# Altium schematic sheet Cube.SchDoc
size A4; SheetNumber: 5; SheetTotal: 5
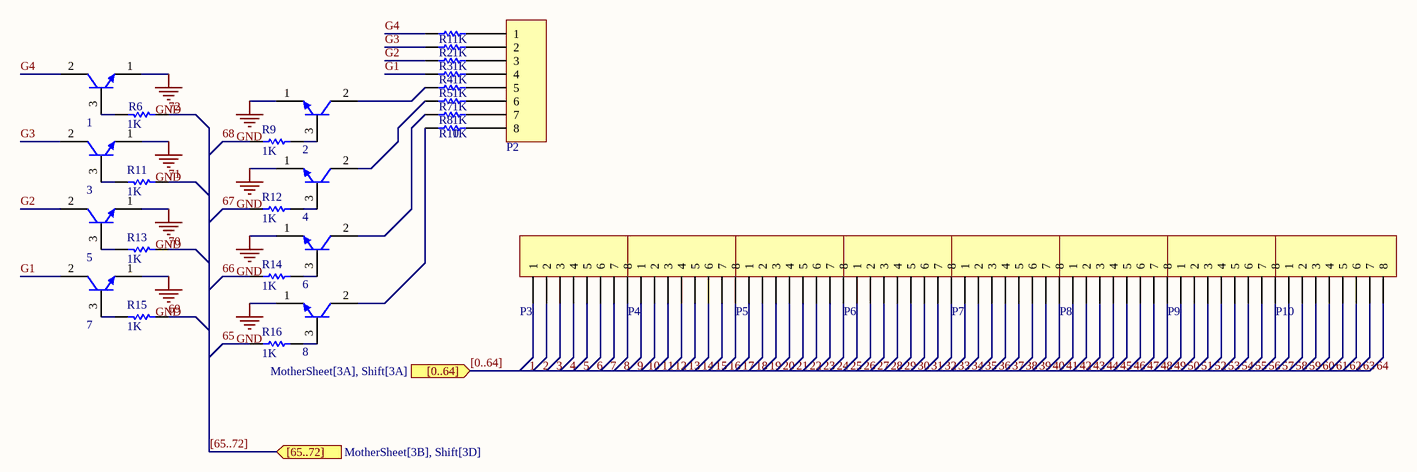
[diagram p0: Cube.SchDoc]

## Parts
1  C1815  [QTO-92]  (value not drawn)
2  C1815  [QTO-92]  (value not drawn)
3  C1815  [QTO-92]  (value not drawn)
4  C1815  [QTO-92]  (value not drawn)
5  C1815  [QTO-92]  (value not drawn)
6  C1815  [QTO-92]  (value not drawn)
7  C1815  [QTO-92]  (value not drawn)
8  C1815  [QTO-92]  (value not drawn)
P2  Header 8  [JP8]  (value not drawn)
P3  Header 8  [JP8]  (value not drawn)
P4  Header 8  [JP8]  (value not drawn)
P5  Header 8  [JP8]  (value not drawn)
P6  Header 8  [JP8]  (value not drawn)
P7  Header 8  [JP8]  (value not drawn)
P8  Header 8  [JP8]  (value not drawn)
P9  Header 8  [JP8]  (value not drawn)
P10  Header 8  [JP8]  (value not drawn)
R1  value 1K  [RES 1/2W]  (hidden comment: RESISTOR)
R2  value 1K  [RES 1/2W]  (hidden comment: RESISTOR)
R3  value 1K  [RES 1/2W]  (hidden comment: RESISTOR)
R4  value 1K  [RES 1/2W]  (hidden comment: RESISTOR)
R5  value 1K  [RES 1/2W]  (hidden comment: RESISTOR)
R6  value 1K  [RES 1/2W]  (hidden comment: RESISTOR)
R7  value 1K  [RES 1/2W]  (hidden comment: RESISTOR)
R8  value 1K  [RES 1/2W]  (hidden comment: RESISTOR)
R9  value 1K  [RES-SM-0805]  (hidden comment: RESISTOR SMD)
R10  value 1K  [RES 1/2W]  (hidden comment: RESISTOR)
R11  value 1K  [RES 1/2W]  (hidden comment: RESISTOR)
R12  value 1K  [RES 1/2W]  (hidden comment: RESISTOR)
R13  value 1K  [RES 1/2W]  (hidden comment: RESISTOR)
R14  value 1K  [RES 1/2W]  (hidden comment: RESISTOR)
R15  value 1K  [RES 1/2W]  (hidden comment: RESISTOR)
R16  value 1K  [RES 1/2W]  (hidden comment: RESISTOR)

## Ports
[0..64] (in, see MotherSheet[3A], Shift[3A]), [65..72] (in, see MotherSheet[3B], Shift[3D])

## Nets
GND: 1.1(E) 2.1(E) 3.1(E) 4.1(E) 5.1(E) 6.1(E) 7.1(E) 8.1(E)
1: P3.1
2: P3.2
3: P3.3
4: P3.4
5: P3.5
6: P3.6
7: P3.7
8: P3.8
9: P4.1
10: P4.2
11: P4.3
12: P4.4
13: P4.5
14: P4.6
15: P4.7
16: P4.8
17: P5.1
18: P5.2
19: P5.3
20: P5.4
21: P5.5
22: P5.6
23: P5.7
24: P5.8
25: P6.1
26: P6.2
27: P6.3
28: P6.4
29: P6.5
30: P6.6
31: P6.7
32: P6.8
33: P7.1
34: P7.2
35: P7.3
36: P7.4
37: P7.5
38: P7.6
39: P7.7
40: P7.8
41: P8.1
42: P8.2
43: P8.3
44: P8.4
45: P8.5
46: P8.6
47: P8.7
48: P8.8
49: P9.1
50: P9.2
51: P9.3
52: P9.4
53: P9.5
54: P9.6
55: P9.7
56: P9.8
57: P10.1
58: P10.2
59: P10.3
60: P10.4
61: P10.5
62: P10.6
63: P10.7
64: P10.8
65: R16.1
66: R14.1
67: R12.1
68: R9.1
69: R15.1
70: R13.1
71: R11.1
72: R6.1
G1: 7.2(C) R4.1
G2: 5.2(C) R3.1
G3: 3.2(C) R2.1
G4: 1.2(C) R1.1
Net1_3: 1.3(B) R6.2
Net2_2: 2.2(C) R5.1
Net2_3: 2.3(B) R9.2
Net3_3: 3.3(B) R11.2
Net4_2: 4.2(C) R7.1
Net4_3: 4.3(B) R12.2
Net5_3: 5.3(B) R13.2
Net6_2: 6.2(C) R8.1
Net6_3: 6.3(B) R14.2
Net7_3: 7.3(B) R15.2
Net8_2: 8.2(C) R10.1
Net8_3: 8.3(B) R16.2
NetP2_1: P2.1 R1.2
NetP2_2: P2.2 R2.2
NetP2_3: P2.3 R3.2
NetP2_4: P2.4 R4.2
NetP2_5: P2.5 R5.2
NetP2_6: P2.6 R7.2
NetP2_7: P2.7 R8.2
NetP2_8: P2.8 R10.2

## Buses and harness runs
bus [0..64] = port [0..64]
bus [65..72] = port [65..72]

## Library data of the parts
1-8 = C1815: NPN Bipolar Transistor
P2-P10 = Header 8: Header, 8-Pin; LatestRevisionDate: 17-Jul-2002; LatestRevisionNote: Re-released for DXP Platform.; Publisher: Altium Limited
R9 = RESISTOR SMD: Resistor